# EAGLE design External-Controls (EAGLE 8.0.0)

## Sheet 1 of 2
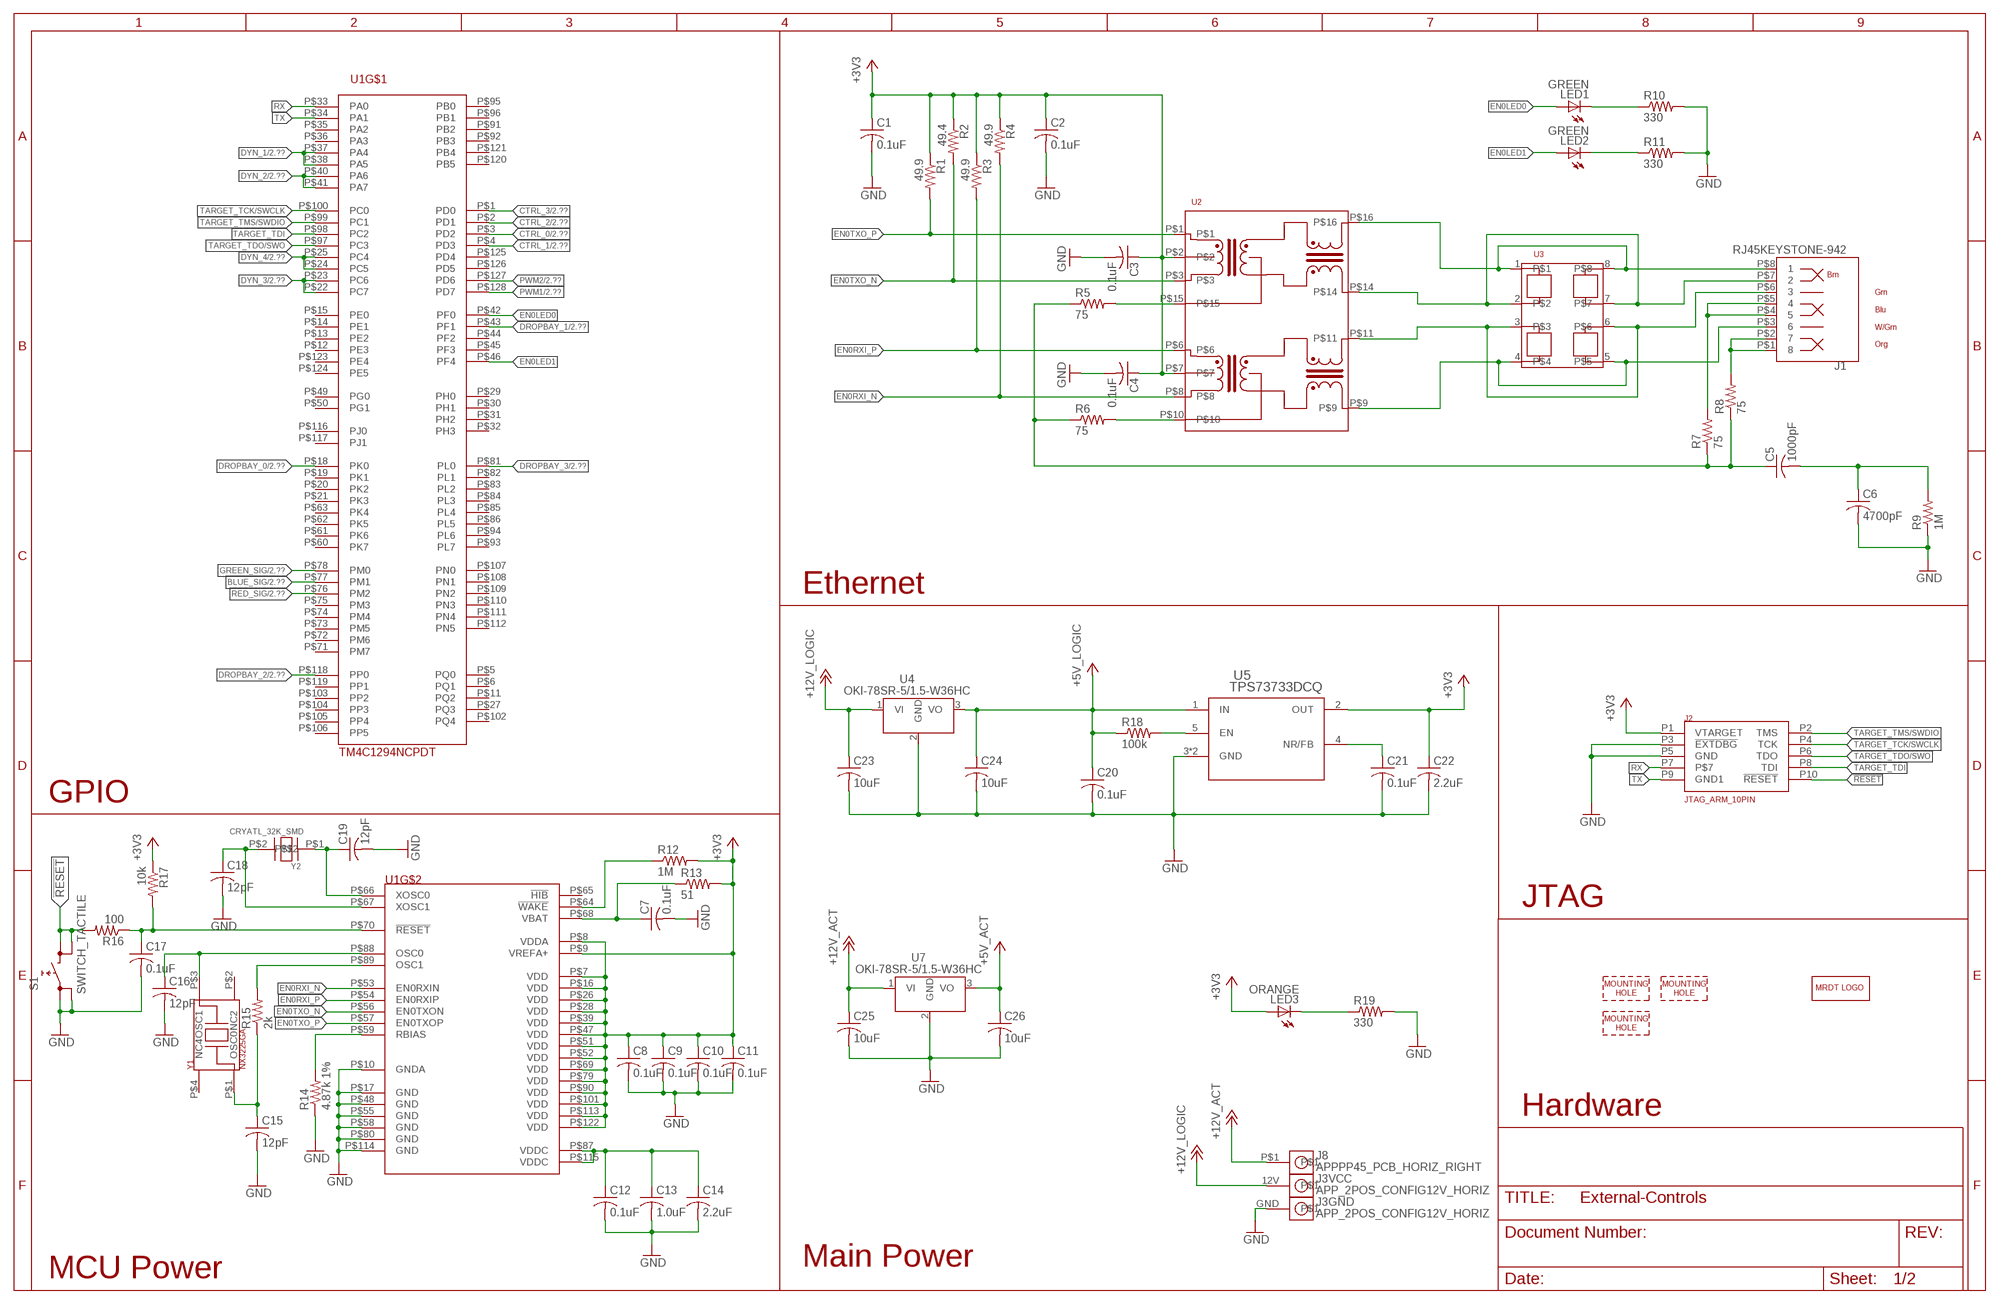
[diagram p0: schematic, sheet 1]

### Parts
C1  0.1uF  C-USC0603  [C0603]
C2  0.1uF  C-USC0603  [C0603]
C3  0.1uF  C-USC0603  [C0603]
C4  0.1uF  C-USC0603  [C0603]
C5  1000pF  C-USC0603  [C0603]
C6  4700pF  C-USC1206  [C1206]
C7  0.1uF  C-USC0603  [C0603]
C8  0.1uF  C-USC0603  [C0603]
C9  0.1uF  C-USC0603  [C0603]
C10  0.1uF  C-USC0603  [C0603]
C11  0.1uF  C-USC0603  [C0603]
C12  0.1uF  C-USC0603  [C0603]
C13  1.0uF  C-USC0603  [C0603]
C14  2.2uF  C-USC0603  [C0603]
C15  12pF  C-USC0603  [C0603]
C16  12pF  C-USC0603  [C0603]
C17  0.1uF  C-USC0603  [C0603]
C18  12pF  C-USC0603  [C0603]
C19  12pF  C-USC0603  [C0603]
C20  0.1uF  C-USC0603  [C0603]
C21  0.1uF  C-USC0603  [C0603]
C22  2.2uF  C-USC0603  [C0603]
C23  10uF  C-USC1206  [C1206]
C24  10uF  C-USC1206  [C1206]
C25  10uF  C-USC1206  [C1206]
C26  10uF  C-USC1206  [C1206]
J1  RJ45KEYSTONE-942  [KEYSTONE-942]
J2  JTAG_ARM_10PIN  [CON_2X5_50MIL]
J3  APP_2POS_CONFIG12V_HORIZ  [APP45_12V_HORIZ_CONFIG]
J8  APPPP45_PCB_HORIZ_RIGHT  [APP45_PCB_HORIZ_RIGHT]
LED1  GREEN  LEDCHIP-LED0603  [CHIP-LED0603]
LED2  GREEN  LEDCHIP-LED0603  [CHIP-LED0603]
LED3  ORANGE  LEDCHIP-LED0603  [CHIP-LED0603]
R1  49.9  R-US_R0603  [R0603]
R2  49.4  R-US_R0603  [R0603]
R3  49.9  R-US_R0603  [R0603]
R4  49.9  R-US_R0603  [R0603]
R5  75  R-US_R0603  [R0603]
R6  75  R-US_R0603  [R0603]
R7  75  R-US_R0603  [R0603]
R8  75  R-US_R0603  [R0603]
R9  1M  R-US_R1206  [R1206]
R10  330  R-US_R0603  [R0603]
R11  330  R-US_R0603  [R0603]
R12  1M  R-US_R0603  [R0603]
R13  51  R-US_R0603  [R0603]
R14  4.87k 1%  R-US_R0603  [R0603]
R15  2k  R-US_R0603  [R0603]
R16  100  R-US_R0603  [R0603]
R17  10k  R-US_R0603  [R0603]
R18  100k  R-US_R0603  [R0603]
R19  330  R-US_R0603  [R0603]
S1  SWITCH_TACTILE  [SWITCH_6MM_6MM_TE_CON_SMD]
U1  TM4C1294NCPDT  [TQFP-128]
U2  HX1198FNL  [HX1198FNL]
U3  SLVU2.8-4  [SOIC8]
U4  OKI-78SR-5/1.5-W36HC  [OKI-78SR_HORIZ]
U5  TPS73733DCQ  [SOT-223-6]
U7  OKI-78SR-5/1.5-W36HC  [OKI-78SR_HORIZ]
U$1  MRDT_LOGO  [MRDT_LOGO]
U$2  MOUNTING_HOLE#6  [#6_SCREW]
U$3  MOUNTING_HOLE#6  [#6_SCREW]
U$4  MOUNTING_HOLE#6  [#6_SCREW]
Y1  NX3225GA  [NDK3.2X2.5]
Y2  CRYATL_32K_SMD  [CRYSTAL_32K_SMD]

### Nets
!RESET: J2.P10(!RESET) R16.2 S1.P$3 S1.P$4
+3V3: C1.1 C2.1 C3.1 C4.1 C8.1 C9.1 C10.1 C11.1 C22.1 J2.P1(VTARGET) LED3.A R1.1 R2.1 R3.1 R4.1 R12.2 R13.2 R17.1 U1.P$7(VDD) U1.P$8(VDDA) U1.P$9(VREFA+) U1.P$16(VDD) U1.P$26(VDD) U1.P$28(VDD) U1.P$39(VDD) U1.P$47(VDD) U1.P$51(VDD) U1.P$52(VDD) U1.P$69(VDD) U1.P$79(VDD) U1.P$90(VDD) U1.P$101(VDD) U1.P$113(VDD) U1.P$122(VDD) U2.P$2 U2.P$7 U5.2(OUT)
+5V_ACT: C26.1 U7.3(VO) ; also sheet 2
+5V_LOGIC: C20.1 C24.1 R18.1 U4.3(VO) U5.1(IN)
+12V_ACT: C25.1 J8.P$1 U7.1(VI) ; also sheet 2
+12V_LOGIC: C23.1 J3.12V U4.1(VI)
BLUE_SIG: U1.P$77(PM1) ; also sheet 2
CTRL_0: U1.P$3(PD2) ; also sheet 2
CTRL_1: U1.P$4(PD3) ; also sheet 2
CTRL_2: U1.P$2(PD1) ; also sheet 2
CTRL_3: U1.P$1(PD0) ; also sheet 2
DROPBAY_0: U1.P$18(PK0) ; also sheet 2
DROPBAY_1: U1.P$43(PF1) ; also sheet 2
DROPBAY_2: U1.P$118(PP0) ; also sheet 2
DROPBAY_3: U1.P$81(PL0) ; also sheet 2
DYN_1: U1.P$37(PA4) U1.P$38(PA5) ; also sheet 2
DYN_2: U1.P$40(PA6) U1.P$41(PA7) ; also sheet 2
DYN_3: U1.P$22(PC7) U1.P$23(PC6) ; also sheet 2
DYN_4: U1.P$24(PC5) U1.P$25(PC4) ; also sheet 2
EN0LED0: LED1.A U1.P$42(PF0)
EN0LED1: LED2.A U1.P$46(PF4)
EN0RXI_N [Ethernet]: R4.2 U1.P$53(EN0RXIN) U2.P$8
EN0RXI_P [Ethernet]: R3.2 U1.P$54(EN0RXIP) U2.P$6
EN0TXO_N [Ethernet]: R2.2 U1.P$56(EN0TXON) U2.P$3
EN0TXO_P [Ethernet]: R1.2 U1.P$57(EN0TXOP) U2.P$1
GND: C1.2 C2.2 C3.2 C4.2 C6.2 C7.2 C8.2 C9.2 C10.2 C11.2 C12.2 C13.2 C14.2 C15.2 C16.2 C17.2 C18.2 C19.2 C20.2 C21.2 C22.2 C23.2 C24.2 C25.2 C26.2 J2.P3(!EXTDBG) J2.P5(GND) J3.GND R9.1 R10.2 R11.2 R14.1 R19.2 S1.P$1 S1.P$2 U1.P$10(GNDA) U1.P$17(GND) U1.P$48(GND) U1.P$55(GND) U1.P$58(GND) U1.P$80(GND) U1.P$114(GND) U4.2(GND) U5.3(GND) U5.6(GND) U7.2(GND) ; also sheet 2
GREEN_SIG: U1.P$78(PM0) ; also sheet 2
N_$1: R5.2 U2.P$15
N_$3: R6.2 U2.P$10
N_$4: J1.P$7 U2.P$14 U3.2 U3.7
N_$5: J1.P$6 U2.P$11 U3.3 U3.6
N_$6: J1.P$8 U2.P$16 U3.1 U3.8
N_$7: J1.P$3 U2.P$9 U3.4 U3.5
N_$8: LED2.C R11.1
N_$9: LED1.C R10.1
N_$10: C7.1 R13.1 U1.P$68(VBAT)
N_$11: J1.P$4 J1.P$5 R7.2
N_$12: R12.1 U1.P$64(!WAKE)
N_$13: J1.P$1 J1.P$2 R8.2
N_$14: C5.1 R5.1 R6.1 R7.1 R8.1
N_$15: C5.2 C6.1 R9.2
N_$16: C12.1 C13.1 C14.1 U1.P$87(VDDC) U1.P$115(VDDC)
N_$17: R15.2 U1.P$89(OSC1)
N_$18: C16.1 U1.P$88(OSC0) Y1.P$3(OSC1)
N_$19: R14.2 U1.P$59(RBIAS)
N_$20: C17.1 R16.1 R17.2 U1.P$70(!RESET)
N_$21: C15.1 R15.1 Y1.P$1(OSC0)
N_$22: C18.1 U1.P$67(XOSC1) Y2.P$2
N_$23: C19.1 U1.P$66(XOSC0) Y2.P$1
N_$25: R18.2 U5.5(EN)
N_$26: LED3.C R19.1
N_$27: C21.1 U5.4(NR/FB)
PWM1: U1.P$128(PD7) ; also sheet 2
PWM2: U1.P$127(PD6) ; also sheet 2
RED_SIG: U1.P$76(PM2) ; also sheet 2
RX: J2.P7 U1.P$33(PA0)
TARGET_TCK/SWCLK: J2.P4(TCK) U1.P$100(PC0)
TARGET_TDI: J2.P8(TDI) U1.P$98(PC2)
TARGET_TDO/SWO: J2.P6(TDO) U1.P$97(PC3)
TARGET_TMS/SWDIO: J2.P2(TMS) U1.P$99(PC1)
TX: J2.P9(GND1) U1.P$34(PA1)
Unconnected: U1.P$5(PQ0) U1.P$6(PQ1) U1.P$11(PQ2) U1.P$12(PE3) U1.P$13(PE2) U1.P$14(PE1) U1.P$15(PE0) U1.P$19(PK1) U1.P$20(PK2) U1.P$21(PK3) U1.P$27(PQ3) U1.P$29(PH0) U1.P$30(PH1) U1.P$31(PH2) U1.P$32(PH3) U1.P$35(PA2) U1.P$36(PA3) U1.P$44(PF2) U1.P$45(PF3) U1.P$49(PG0) U1.P$50(PG1) U1.P$60(PK7) U1.P$61(PK6) U1.P$62(PK5) U1.P$63(PK4) U1.P$65(!HIB) U1.P$71(PM7) U1.P$72(PM6) U1.P$73(PM5) U1.P$74(PM4) U1.P$75(PM3) U1.P$82(PL1) U1.P$83(PL2) U1.P$84(PL3) U1.P$85(PL4) U1.P$86(PL5) U1.P$91(PB2) U1.P$92(PB3) U1.P$93(PL7) U1.P$94(PL6) U1.P$95(PB0) U1.P$96(PB1) U1.P$102(PQ4) U1.P$103(PP2) U1.P$104(PP3) U1.P$105(PP4) U1.P$106(PP5) U1.P$107(PN0) U1.P$108(PN1) U1.P$109(PN2) U1.P$110(PN3) U1.P$111(PN4) U1.P$112(PN5) U1.P$116(PJ0) U1.P$117(PJ1) U1.P$119(PP1) U1.P$120(PB5) U1.P$121(PB4) U1.P$123(PE4) U1.P$124(PE5) U1.P$125(PD4) U1.P$126(PD5) Y1.P$2(NC2) Y1.P$4(NC4)

### Notes on the sheet
- Ethernet
- GPIO
- JTAG
- Hardware
- Main Power
- MCU Power

## Sheet 2 of 2
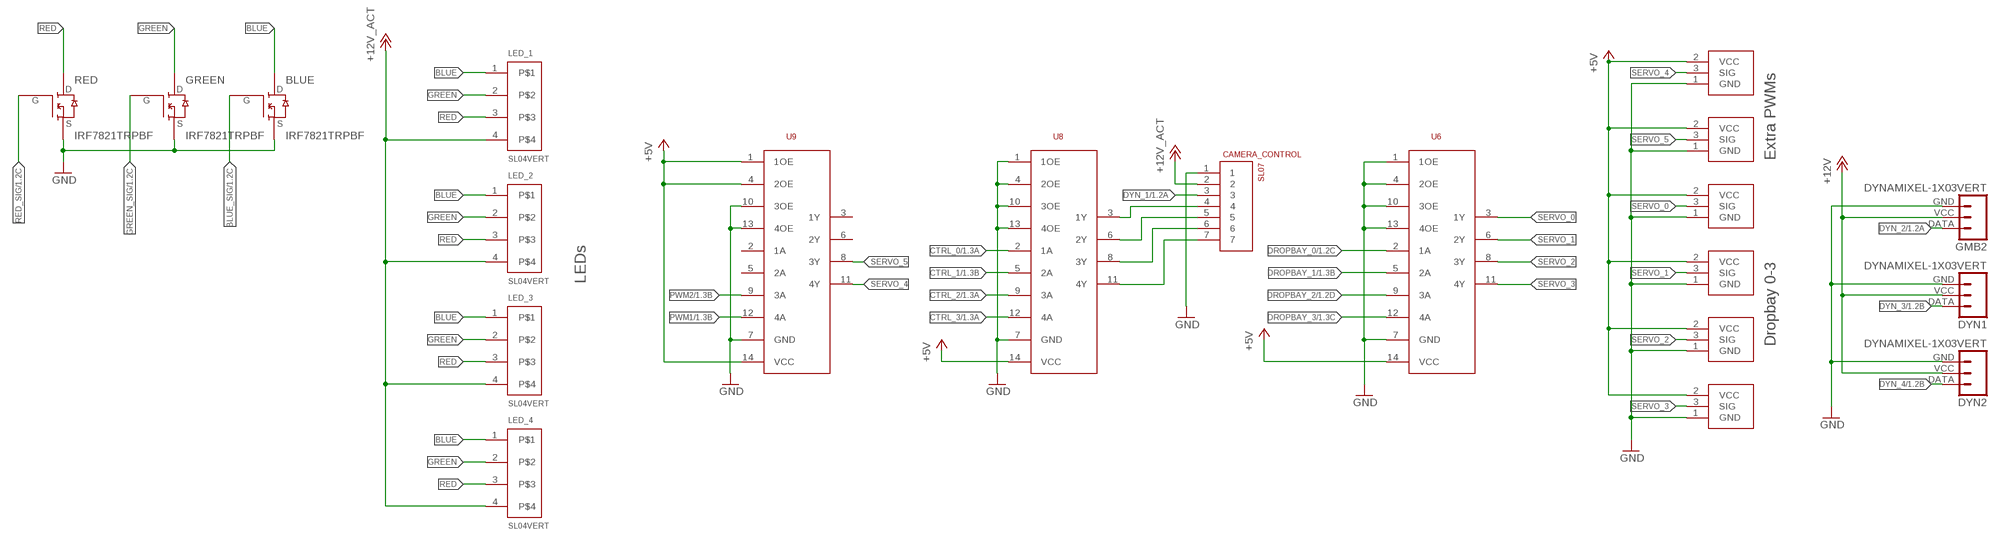
[diagram p1: schematic, sheet 2]

### Parts
BLUE  IRF7821TRPBF  [SOIC8]
CAMERA_CONTROL  SL07  [MOLEX-70543-0006]
DROP0  SERVOMOLEX_SL_VERT_TH  [MOLEX-70543-0002]
DROP1  SERVOMOLEX_SL_VERT_TH  [MOLEX-70543-0002]
DROP2  SERVOMOLEX_SL_VERT_TH  [MOLEX-70543-0002]
DROP3  SERVOMOLEX_SL_VERT_TH  [MOLEX-70543-0002]
DYN1  DYNAMIXEL-1X03VERT  [MLX-SPOX5267-3PIN]
DYN2  DYNAMIXEL-1X03VERT  [MLX-SPOX5267-3PIN]
GMB2  DYNAMIXEL-1X03VERT  [MLX-SPOX5267-3PIN]
GREEN  IRF7821TRPBF  [SOIC8]
LED_1  SL04VERT  [MOLEX-70543-0003]
LED_2  SL04VERT  [MOLEX-70543-0003]
LED_3  SL04VERT  [MOLEX-70543-0003]
LED_4  SL04VERT  [MOLEX-70543-0003]
PWM1  SERVOMOLEX_SL_VERT_TH  [MOLEX-70543-0002]
PWM2  SERVOMOLEX_SL_VERT_TH  [MOLEX-70543-0002]
RED  IRF7821TRPBF  [SOIC8]
U6  SN74AHCT125  [SOIC14]
U8  SN74AHCT125  [SOIC14]
U9  SN74AHCT125  [SOIC14]

### Nets
+5V_ACT: DROP0.2(VCC) DROP1.2(VCC) DROP2.2(VCC) DROP3.2(VCC) PWM1.2(VCC) PWM2.2(VCC) U6.14(VCC) U8.14(VCC) U9.1(1OE) U9.4(2OE) U9.14(VCC) ; supply symbol labelled +5V ; also sheet 1
+12V_ACT: CAMERA_CONTROL.2 DYN1.VCC DYN2.VCC GMB2.VCC LED_1.4 LED_2.4 LED_3.4 LED_4.4 ; supply symbol labelled +12V ; also sheet 1
BLUE: BLUE.5(D) BLUE.6(D) BLUE.7(D) BLUE.8(D) LED_1.1 LED_2.1 LED_3.1 LED_4.1
BLUE_SIG: BLUE.4(G) ; also sheet 1
CAM_PWM_0: CAMERA_CONTROL.4 U8.3(1Y)
CAM_PWM_1: CAMERA_CONTROL.5 U8.6(2Y)
CAM_PWM_2: CAMERA_CONTROL.6 U8.8(3Y)
CAM_PWM_3: CAMERA_CONTROL.7 U8.11(4Y)
CTRL_0: U8.2(1A) ; also sheet 1
CTRL_1: U8.5(2A) ; also sheet 1
CTRL_2: U8.9(3A) ; also sheet 1
CTRL_3: U8.12(4A) ; also sheet 1
DROPBAY_0: U6.2(1A) ; also sheet 1
DROPBAY_1: U6.5(2A) ; also sheet 1
DROPBAY_2: U6.9(3A) ; also sheet 1
DROPBAY_3: U6.12(4A) ; also sheet 1
DYN_1: CAMERA_CONTROL.3 ; also sheet 1
DYN_2: GMB2.DATA ; also sheet 1
DYN_3: DYN1.DATA ; also sheet 1
DYN_4: DYN2.DATA ; also sheet 1
GND: BLUE.1(S) BLUE.2(S) BLUE.3(S) CAMERA_CONTROL.1 DROP0.1(GND) DROP1.1(GND) DROP2.1(GND) DROP3.1(GND) DYN1.GND DYN2.GND GMB2.GND GREEN.1(S) GREEN.2(S) GREEN.3(S) PWM1.1(GND) PWM2.1(GND) RED.1(S) RED.2(S) RED.3(S) U6.1(1OE) U6.4(2OE) U6.7(GND) U6.10(3OE) U6.13(4OE) U8.1(1OE) U8.4(2OE) U8.7(GND) U8.10(3OE) U8.13(4OE) U9.7(GND) U9.10(3OE) U9.13(4OE) ; also sheet 1
GREEN: GREEN.5(D) GREEN.6(D) GREEN.7(D) GREEN.8(D) LED_1.2 LED_2.2 LED_3.2 LED_4.2
GREEN_SIG: GREEN.4(G) ; also sheet 1
PWM1: U9.12(4A) ; also sheet 1
PWM2: U9.9(3A) ; also sheet 1
RED: LED_1.3 LED_2.3 LED_3.3 LED_4.3 RED.5(D) RED.6(D) RED.7(D) RED.8(D)
RED_SIG: RED.4(G) ; also sheet 1
SERVO_0: DROP0.3(SIG) U6.3(1Y)
SERVO_1: DROP1.3(SIG) U6.6(2Y)
SERVO_2: DROP2.3(SIG) U6.8(3Y)
SERVO_3: DROP3.3(SIG) U6.11(4Y)
SERVO_4: PWM2.3(SIG) U9.11(4Y)
SERVO_5: PWM1.3(SIG) U9.8(3Y)
Unconnected: U9.2(1A) U9.3(1Y) U9.5(2A) U9.6(2Y)

### Notes on the sheet
- Extra PWMs
- LEDs
- Dropbay 0-3

## Library data of the parts
BLUE GREEN RED = MRDT-Semiconductors:IRF7821TRPBF: MOSFET N-CH 30V 13.6A; PARTNO: IRF7821TRPBF
C1-C26 = resistor:C-US: CAPACITOR, American symbol
CAMERA_CONTROL = MRDT-Connectors:SL07
DROP0 DROP1-DROP3 PWM1 PWM2 = MRDT-Connectors:SERVO
DYN1 DYN2 GMB2 = MRDT-Connectors:DYNAMIXEL-1X03; MFR: Molex; MFR_PN: 0022035035; ORIENT: Vert
J1 = MRDT-Connectors:RJ45
J2 = MRDT-Connectors:JTAG_ARM_10PIN; PARTNO: M50-3600542
J3 = MRDT-Connectors:APP_2POS_CONFIG; COLOR1: YELLOW; COLOR2: BLACK
J8 = MRDT-Connectors:APP: http://www.powerwerx.com/anderson-powerpoles/
LED1-LED3 = led:LED: LED OSRAM: - CHIPLED LG R971, LG N971, LY N971, LG Q971, LY Q971, LO R971, LY R971 LH N974, LH R974 LS Q976, LO Q976, LY Q976 LO Q996 - Hyper CHIPLED LW Q18S LB Q993, LB Q99A, LB R99A - SideLED LS A670, LO A670, LY A670, LG A670, LP A670 LB A673, LV A673, LT A673, LW A673 LH A674 LY A675 LS A676, LA A676, LO A676, LY A676, LW A676 LS A679, LY A679, LG A679 - Hyper Micro SIDELED® LS Y876, LA Y876, LO Y876, LY Y876 LT Y87S - SmartLED LW L88C, LW L88S LB L89C, LB L89S, LG L890 LS L89K, LO L89K, LY L89K LS L896, LA L896, LO L896, LY L896 - TOPLED LS T670, LO T670, LY T670, LG T670, LP T670 LSG T670, LSP T670, LSY T670, LOP T670, LYG T670 LG T671, LOG T671, LSG T671 LB T673, LV T673, LT T673, LW T673 LH T674 LS T676, LA T676, LO T676, LY T676, LB T676, LH T676, LSB T676, LW T676 LB T67C, LV T67C, LT T67C, LS T67K, LO T67K, LY T67K, LW E67C LS E67B, LA E67B, LO E67B, LY E67B, LB E67C, LV E67C, LT E67C LW T67C LS T679, LY T679, LG T679 LS T770, LO T770, LY T770, LG T770, LP T770 LB T773, LV T773, LT T773, LW T773 LH T774 LS E675, LA E675, LY E675, LS T675 LS T776, LA T776, LO T776, LY T776, LB T776 LHGB T686 LT T68C, LB T68C - Hyper Mini TOPLED® LB M676 - Mini TOPLED Santana® LG M470 LS M47K, LO M47K, LY M47K Source: http://www.osram.convergy.de LUXEON: - LUMILED® LXK2-PW12-R00, LXK2-PW12-S00, LXK2-PW14-U00, LXK2-PW14-V00 LXK2-PM12-R00, LXK2-PM12-S00, LXK2-PM14-U00 LXK2-PE12-Q00, LXK2-PE12-R00, LXK2-PE12-S00, LXK2-PE14-T00, LXK2-PE14-U00 LXK2-PB12-K00, LXK2-PB12-L00, LXK2-PB12-M00, LXK2-PB14-N00, LXK2-PB14-P00, LXK2-PB14-Q00 LXK2-PR12-L00, LXK2-PR12-M00, LXK2-PR14-Q00, LXK2-PR14-R00 LXK2-PD12-Q00, LXK2-PD12-R00, LXK2-PD12-S00 LXK2-PH12-R00, LXK2-PH12-S00 LXK2-PL12-P00, LXK2-PL12-Q00, LXK2-PL12-R00 Source: www.luxeon.com KINGBRIGHT: KA-3528ASYC Source: www.kingbright.com
LED_1-LED_4 = MRDT-Connectors:SL04
R1 = rcl:R-US_: RESISTOR, American symbol
R2-R19 = resistor:R-US_: RESISTOR, American symbol
S1 = MRDT-UserInput:SWITCH_TACTILE
U1 = MRDT-Microcontrollers:TM4C1294NCPDT
U2 = MRDT-ICs:HX1198FNL
U3 = MRDT-ICs:SLVU2.8-4
U4 U7 = MRDT-ICs:OKI-78SR-*/1.5-W36?C: 4.95W DC/DC Converter Manufacturer: Murata; VOUT: +5v
U5 = MRDT-ICs:TPS73733*: LDO with Reverse Current Protection
U6 U8 U9 = MRDT-ICs:SN74AHCT125: part # SN74AHCT125 QUADRUPLE BUS BUFFER GATES WITH 3-STATE OUTPUTS http://www.digikey.com/product-detail/en/SN74AHCT125DR/296-4652-1-ND/405208; PARTNO: SN74AHCT125
U$1 = MRDT-Hardware:MRDT_LOGO
U$2-U$4 = MRDT-Hardware:MOUNTING_HOLE: Mounting hole for M6 bolt. Standard use mounting hole for: Tiva C Connected - M6 Anderson Powerpole Mounting Wing - M8 Most frame-mounted PCB's - M8
Y1 = MRDT-Passives:NX3225GA
Y2 = MRDT-Passives:CRYATL_32K_SMD

## Net classes
2 Ethernet: width 0.22 mm, clearance 0.152 mm

## Board
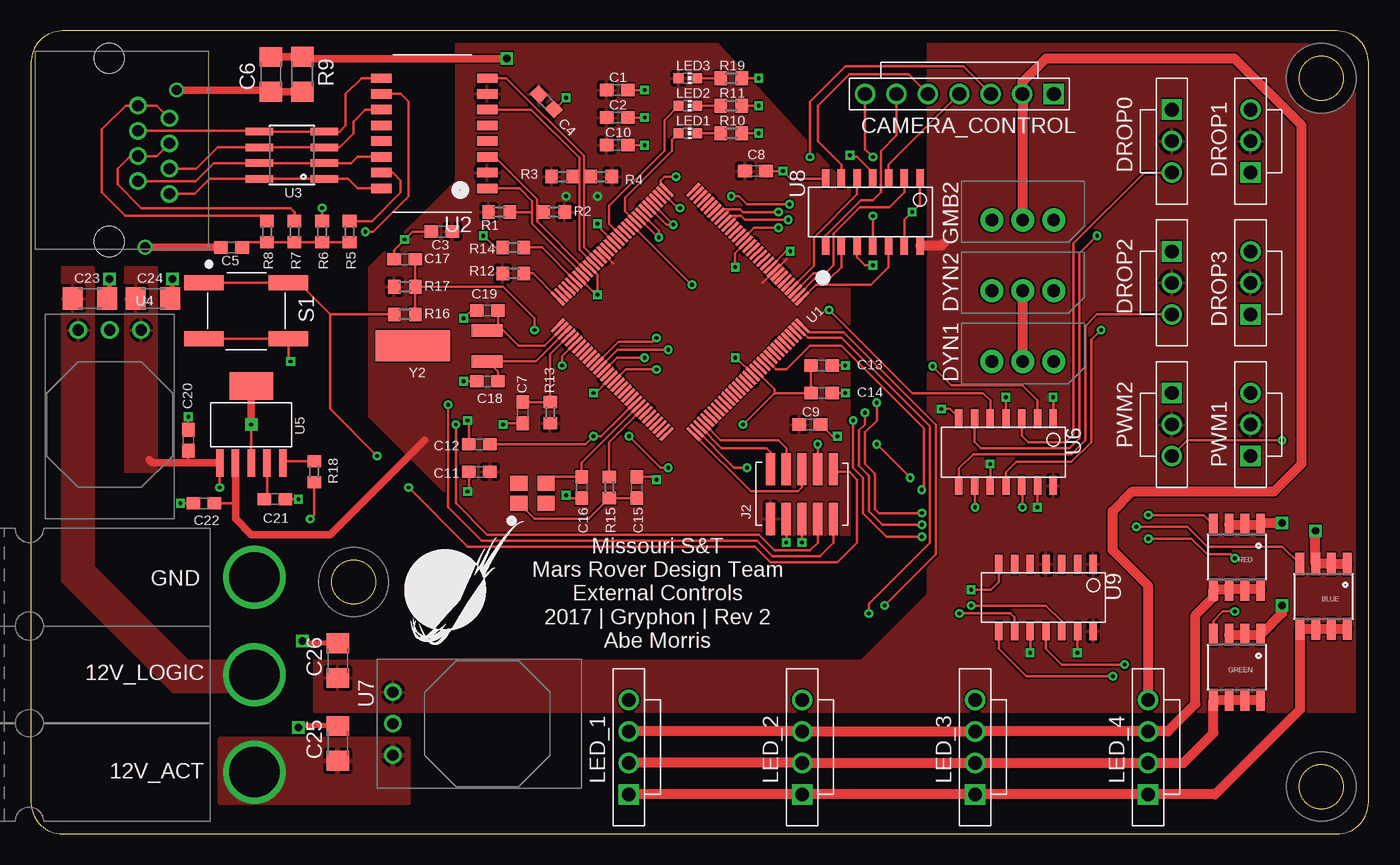
[diagram p2: board, top side]
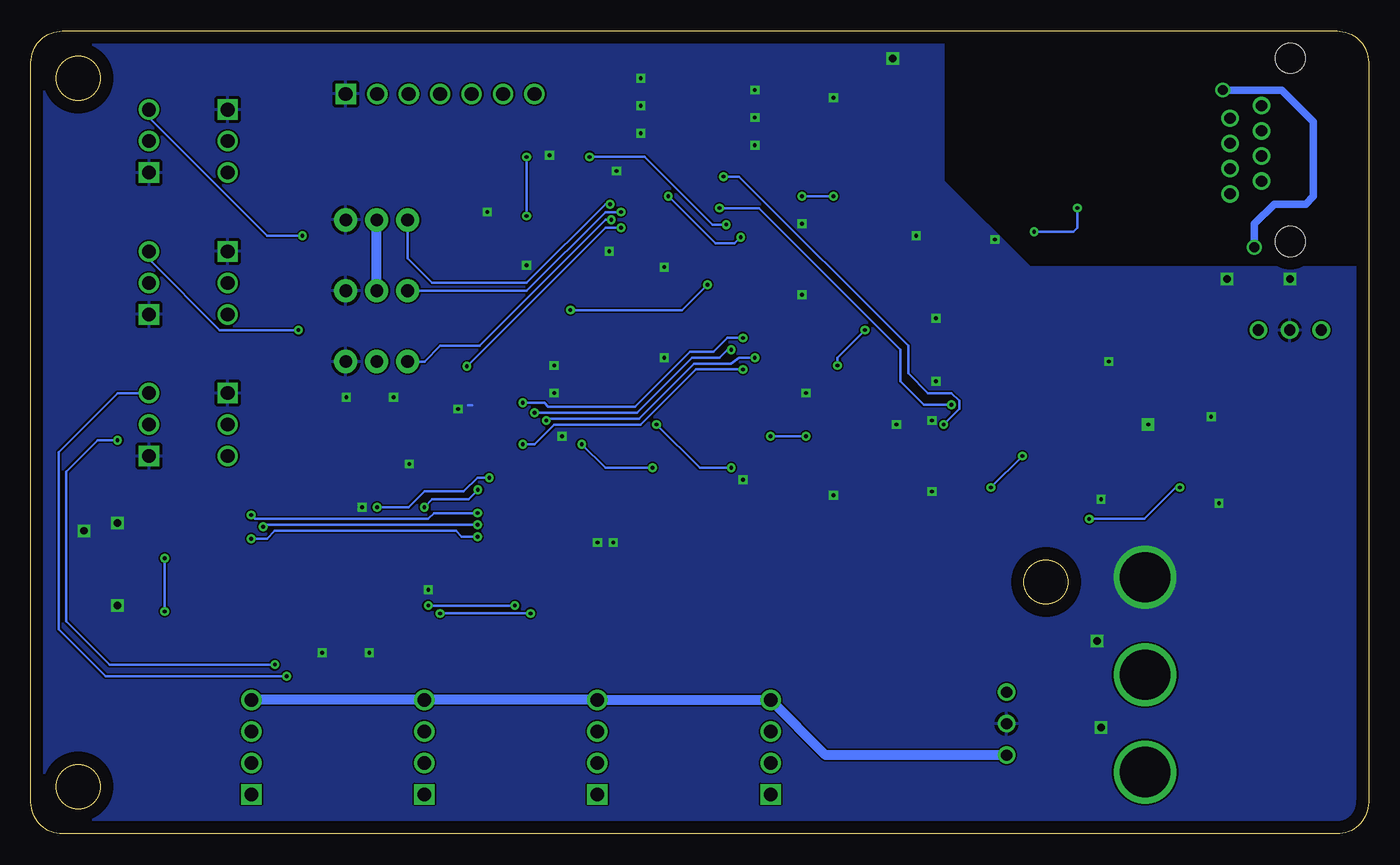
[diagram p3: board, bottom side, seen from below]

Size 107.95 x 64.77 mm. Coordinates in mm from the lower left corner, seen from the top.
Outline: 0,62.23 0,2.54 arc90 2.54,0 105.41,0 arc90 107.95,2.54 107.95,62.23 arc90 105.41,64.77 2.54,64.77 arc90 0,62.23
Copper layers (1*16): Top 0.035mm / dielectric 1.5mm / Bottom 0.035mm
Design rules "advanced_circuits_standard *": minimum track width 5mil, minimum drill 10mil, track to track 5mil, track to pad 5mil, pad to pad 5mil, via to via 5mil, smd to smd 5mil, copper to edge 40mil, drill to drill 5mil, minimum pad ring 10mil, minimum via ring 8mil, stop-mask expansion 4mil, vias tented up to drill 0mil, thermal gap 10mil

### Footprints (pad centres in the part's own frame; a part is rotated, then mirrored left to right if it is on the bottom)
SOIC8 = smd 0.711 x 1.778: 1 0.457,-0.813; 2 1.727,-0.813; 3 2.997,-0.813; 4 4.267,-0.813; 5 4.267,4.419; 6 2.997,4.419; 7 1.727,4.419; 8 0.457,4.419
C0603 = smd 1.1 x 1: 1 -0.85,0; 2 0.85,0
C1206 = smd 1.6 x 1.8: 1 -1.4,0; 2 1.4,0
MOLEX-70543-0006 = drill 1.1 square: 1 7.62,0 | drill 1.1: 2 5.08,0; 3 2.54,0; 4 0,0; 5 -2.54,0; 6 -5.08,0; 7 -7.62,0
MOLEX-70543-0002 = drill 1.1 square: 1 2.54,0 | drill 1.1: 2 0,0; 3 -2.54,0
MLX-SPOX5267-3PIN = drill 1.016 pad 1.88: DATA 5,0; GND 0,0; VCC 2.5,0
KEYSTONE-942 = drill 0.9: P$1 3.8,2.289; P$2 4.816,4.829; P$3 5.832,2.289; P$4 6.848,4.829; P$5 7.864,2.289; P$6 8.88,4.829; P$7 9.896,2.289; P$8 10.912,4.829 | hole 2.413: -0.023,-0.023; 14.76,-0.023
CON_2X5_50MIL = smd 0.74 x 2.6: P1 0,0; P2 0,4.008; P3 1.27,0; P4 1.27,4.008; P5 2.54,0; P6 2.54,4.008; P7 3.81,0; P8 3.81,4.008; P9 5.08,0; P10 5.08,4.008
APP45_12V_HORIZ_CONFIG = drill 4.064: 12V 28.194,3.937; GND 28.194,11.811
APP45_PCB_HORIZ_RIGHT = drill 4.064: P$1 28.194,3.969
CHIP-LED0603 = smd 0.8 x 0.8: A 0,-0.75; C 0,0.75
MOLEX-70543-0003 = drill 1.1 square: 1 3.81,0 | drill 1.1: 2 1.27,0; 3 -1.27,0; 4 -3.81,0
R0603 = smd 1 x 1.1: 1 -0.85,0; 2 0.85,0
R1206 = smd 1.6 x 1.803: 1 -1.422,0; 2 1.422,0
SWITCH_6MM_6MM_TE_CON_SMD = smd 1.2 x 3.2: P$1 4.521,6.807; P$2 4.521,0; P$3 0,6.807; P$4 0,0
TQFP-128 = smd 1.45 x 0.25: P$1 0,0; P$2 0,-0.4; P$3 0,-0.8; P$4 0,-1.2; P$5 0,-1.6; P$6 0,-2; P$7 0,-2.4; P$8 0,-2.8; P$9 0,-3.2; P$10 0,-3.6; P$11 0,-4; P$12 0,-4.4; P$13 0,-4.8; P$14 0,-5.2; P$15 0,-5.6; P$16 0,-6; P$17 0,-6.4; P$18 0,-6.8; P$19 0,-7.2; P$20 0,-7.6; P$21 0,-8; P$22 0,-8.4; P$23 0,-8.8; P$24 0,-9.2; P$25 0,-9.6; P$26 0,-10; P$27 0,-10.4; P$28 0,-10.8; P$29 0,-11.2; P$30 0,-11.6; P$31 0,-12; P$32 0,-12.4; P$65 15.45,-12.4; P$66 15.45,-12; P$67 15.45,-11.6; P$68 15.45,-11.2; P$69 15.45,-10.8; P$70 15.45,-10.4; P$71 15.45,-10; P$72 15.45,-9.6; P$73 15.45,-9.2; P$74 15.45,-8.8; P$75 15.45,-8.4; P$76 15.45,-8; P$77 15.45,-7.6; P$78 15.45,-7.2; P$79 15.45,-6.8; P$80 15.45,-6.4; P$81 15.45,-6; P$82 15.45,-5.6; P$83 15.45,-5.2; P$84 15.45,-4.8; P$85 15.45,-4.4; P$86 15.45,-4; P$87 15.45,-3.6; P$88 15.45,-3.2; P$89 15.45,-2.8; P$90 15.45,-2.4; P$91 15.45,-2; P$92 15.45,-1.6; P$93 15.45,-1.2; P$94 15.45,-0.8; P$95 15.45,-0.4; P$96 15.45,0 | smd 0.25 x 1.45: P$33 1.525,-13.925; P$34 1.925,-13.925; P$35 2.325,-13.925; P$36 2.725,-13.925; P$37 3.125,-13.925; P$38 3.525,-13.925; P$39 3.925,-13.925; P$40 4.325,-13.925; P$41 4.725,-13.925; P$42 5.125,-13.925; P$43 5.525,-13.925; P$44 5.925,-13.925; P$45 6.325,-13.925; P$46 6.725,-13.925; P$47 7.125,-13.925; P$48 7.525,-13.925; P$49 7.925,-13.925; P$50 8.325,-13.925; P$51 8.725,-13.925; P$52 9.125,-13.925; P$53 9.525,-13.925; P$54 9.925,-13.925; P$55 10.325,-13.925; P$56 10.725,-13.925; P$57 11.125,-13.925; P$58 11.525,-13.925; P$59 11.925,-13.925; P$60 12.325,-13.925; P$61 12.725,-13.925; P$62 13.125,-13.925; P$63 13.525,-13.925; P$64 13.925,-13.925; P$97 13.925,1.525; P$98 13.525,1.525; P$99 13.125,1.525; P$100 12.725,1.525; P$101 12.325,1.525; P$102 11.925,1.525; P$103 11.525,1.525; P$104 11.125,1.525; P$105 10.725,1.525; P$106 10.325,1.525; P$107 9.925,1.525; P$108 9.525,1.525; P$109 9.125,1.525; P$110 8.725,1.525; P$111 8.325,1.525; P$112 7.925,1.525; P$113 7.525,1.525; P$114 7.125,1.525; P$115 6.725,1.525; P$116 6.325,1.525; P$117 5.925,1.525; P$118 5.525,1.525; P$119 5.125,1.525; P$120 4.725,1.525; P$121 4.325,1.525; P$122 3.925,1.525; P$123 3.525,1.525; P$124 3.125,1.525; P$125 2.725,1.525; P$126 2.325,1.525; P$127 1.925,1.525; P$128 1.525,1.525
HX1198FNL = smd 0.76 x 1.67: P$1 0,0; P$2 1.27,0; P$3 2.54,0; P$4 3.81,0; P$5 5.08,0; P$6 6.35,0; P$7 7.62,0; P$8 8.89,0; P$9 8.89,8.55; P$10 7.62,8.55; P$11 6.35,8.55; P$12 5.08,8.55; P$13 3.81,8.55; P$14 2.54,8.55; P$15 1.27,8.55; P$16 0,8.55
SOIC8' = smd 0.6 x 2.2: 1 0.457,-0.813; 2 1.727,-0.813; 3 2.997,-0.813; 4 4.267,-0.813; 5 4.267,4.419; 6 2.997,4.419; 7 1.727,4.419; 8 0.457,4.419
OKI-78SR_HORIZ = drill 0.9 pad 1.422: 1 0,0; 2 -2.54,0; 3 -5.08,0
SOT-223-6 = smd 0.6 x 2.2: 1 -2.54,-3.1; 2 -1.27,-3.1; 3 0,-3.1; 4 1.27,-3.1; 5 2.54,-3.1 | smd 3.5 x 2.2: 6 0,3.1
SOIC14 = smd 1.5 x 0.6: 1 1.11,10.16; 2 1.11,8.89; 3 1.11,7.62; 4 1.11,6.35; 5 1.11,5.08; 6 1.11,3.81; 7 1.11,2.54; 8 6.51,2.54; 9 6.51,3.81; 10 6.51,5.08; 11 6.51,6.35; 12 6.51,7.62; 13 6.51,8.89; 14 6.51,10.16
NDK3.2X2.5 = smd 1.4 x 1.2: P$1 0,0; P$2 2.2,0; P$3 2.2,1.6; P$4 0,1.6
CRYSTAL_32K_SMD = smd 2.5 x 1: P$1 0,1.25; P$2 0,-1.25 | smd 6 x 2.5: P$3 -6,0

### Placement (x,y rotation side)
BLUE  106.68,20.95 180 top
C1  47.31,60.01 0 top
C2  47.31,57.78 0 top
C3  33.15,48.58 180 top
C4  41.59,59.05 315 top
C5  16.19,47.31 180 top
C6  19.37,61.28 90 top
C7  39.69,33.97 270 top
C8  58.47,53.47 0 top
C9  62.87,33.02 0 top
C10  47.31,55.56 0 top
C11  36.2,29.21 180 top
C12  36.2,31.43 180 top
C13  63.82,37.78 0 top
C14  63.82,35.56 0 top
C15  48.9,27.94 90 top
C16  44.45,27.94 270 top
C17  30.16,46.35 180 top
C18  36.83,36.51 180 top
C19  36.83,42.23 180 top
C20  12.7,31.75 90 top
C21  19.68,26.99 0 top
C22  13.97,26.67 180 top
C23  4.76,43.18 0 top
C24  9.84,43.18 0 top
C25  24.77,7.3 90 top
C26  24.77,13.97 90 top
CAMERA_CONTROL  74.93,59.69 0 top
DROP0  92.08,55.88 90 top
DROP1  98.42,55.88 270 top
DROP2  92.08,44.45 90 top
DROP3  98.42,44.45 270 top
DYN1  82.55,38.1 180 top
DYN2  82.55,43.81 180 top
GMB2  82.55,49.53 180 top
GREEN  99.69,15.24 180 top
J1  6.35,62.55 270 top
J2  59.69,25.4 0 top
J3  -10.16,8.89 0 top
J8  -10.16,1.02 0 top
LED1  53.02,56.52 270 top
LED2  53.02,58.74 270 top
LED3  53.02,60.96 270 top
LED_1  48.26,6.99 270 top
LED_2  62.23,6.99 270 top
LED_3  76.2,6.99 270 top
LED_4  90.17,6.99 270 top
PWM1  98.42,33.02 270 top
PWM2  92.08,33.02 90 top
R1  37.78,50.16 0 top
R2  42.23,50.16 180 top
R3  42.86,53.02 0 top
R4  46.04,53.02 180 top
R5  25.72,48.58 90 top
R6  23.5,48.58 90 top
R7  21.27,48.58 90 top
R8  19.05,48.58 90 top
R9  21.91,61.28 270 top
R10  56.52,56.52 0 top
R11  56.52,58.74 0 top
R12  38.93,45.21 180 top
R13  41.91,33.97 270 top
R14  38.93,47.31 0 top
R15  46.67,27.94 90 top
R16  30.16,41.91 180 top
R17  30.16,44.13 0 top
R18  22.86,29.21 90 top
R19  56.52,60.96 0 top
RED  99.69,24.13 180 top
S1  13.97,44.45 270 top
U1  62.23,43.18 225 top
U2  36.83,52.07 90 top
U3  SLVU2.8-4  [SOIC8']  22.86,52.39 90 top
U4  3.81,40.64 180 top
U5  17.78,33.02 0 top
U6  72.34,34.59 270 top
U7  29.21,6.35 270 top
U8  61.59,53.98 270 top
U9  75.56,22.86 270 top
U$1  30.12,14.4 0 top
U$2  104.14,3.81 0 top
U$3  26.04,20.32 0 top
U$4  104.14,60.96 90 top
Y1  39.37,26.67 0 top
Y2  36.83,39.37 0 top

### Tracks (layer width: path | path; a pad name or v marks a point on that pad's centre or on a via)
!RESET  (via drill 0.3)
  Top 0.203: J2.P10 64.97,29.21 66.04,29.21 66.67,28.57 66.67,23.5 65.09,21.91 59.69,21.91 58.42,23.18 35.24,23.18 v30.48,27.94 | v27.94,30.48 24.13,34.29 24.13,41.91 | R16.2 24.13,41.91 | 24.13,41.91 21.59,44.45 S1.P$3 S1.P$4
  Bottom 0.203: v30.48,27.94 v27.94,30.48
+3V3  (via drill 0.3)
  Top 0.203: C22.1 16.51,26.67 | U1.P$51 46.21,46.81 46.99,46.04 | U1.P$9 60.05,45.44 | 60.05,45.44 60.96,46.35 | 60.05,45.44 59.05,44.45
  Top 0.61: U5.2 16.51,26.67 16.51,25.4 17.78,24.13 24.13,24.13 31.75,31.75
  Bottom 0.203: v43.18,51.44 v45.72,51.44
  pour Top: 34.29,66.04 34.29,52.7 27.3,45.72 27.3,33.66 36.83,24.13 66.04,24.13 66.04,52.07 53.34,66.04
+5V_ACT
  Top 0.813: U8.14 73.5,47.47 73.66,47.62
  pour Top: 113.03,9.84 113.03,66.04 72.39,66.04 72.39,9.84
  pour Top: 22.86,9.84 22.86,13.97 66.99,13.97 72.71,19.68 72.71,9.84
+5V_LOGIC  (via drill 0.3)
  Top 0.203: C20.1 12.7,29.92 | R18.1 22.86,25.72 v22.54,25.4 | v15.24,27.94 U5.1
  Top 0.61: U5.1 12.7,29.92 9.77,29.92 9.53,30.16
  Bottom 0.203: v22.54,25.4 18.1,25.4 15.56,27.94 v15.24,27.94
  pour Top: 7.62,45.72 7.62,29.21 10.16,29.21 10.16,45.72
+12V_ACT
  Top 0.813: DYN1.VCC DYN2.VCC | GMB2.VCC 80.05,58.38 CAMERA_CONTROL.2 80.01,60.64 81.92,62.55 97.16,62.55 102.55,57.15 102.55,29.84 100.33,27.62 88.9,27.62 87.31,26.04 87.31,22.86 90.17,20 LED_4.4
  Bottom 0.813: DYN2.VCC GMB2.VCC | LED_4.4 LED_3.4 LED_2.4 LED_1.4 43.81,6.35 U7.1
  pour Top: 15.24,7.62 15.24,2.54 30.48,2.54 30.48,7.62
+12V_LOGIC
  pour Top: 2.54,45.72 5.08,45.72 5.08,21.59 12.7,13.97 19.05,13.97 19.05,11.43 11.43,11.43 2.54,20.32
BLUE
  Top 0.813: LED_1.1 LED_2.1 LED_3.1 LED_4.1 95.57,3.17 102.41,10.02 BLUE.5 BLUE.6 BLUE.7 BLUE.8
BLUE_SIG  (via drill 0.3)
  Top 0.203: U1.P$77 47.35,39.05 v51.44,39.05 | v67.31,33.97 67.31,33.02 66.83,32.54 66.83,29.69 67.63,28.89 67.63,26.04 68.74,24.92 v71.91,24.92 | v89.22,24.77 93.34,24.77 94.93,23.18 101,23.18 BLUE.4
  Bottom 0.203: v51.44,39.05 51.75,39.05 52.39,38.42 54.61,38.42 59.05,33.97 v67.31,33.97 | v71.91,24.92 89.06,24.92 v89.22,24.77
CAM_PWM_0
  Top 0.203: U8.3 69.22,53.98 CAMERA_CONTROL.4
CAM_PWM_1
  Top 0.203: U8.6 65.41,53.98 63.5,55.88 63.5,58.74 66.04,61.28 70.8,61.28 CAMERA_CONTROL.5
CAM_PWM_2
  Top 0.203: U8.8 64.14,48.26 66.99,51.12 67.94,51.12 68.58,51.75 68.58,55.09 69.85,56.36 CAMERA_CONTROL.6
CAM_PWM_3  (via drill 0.3)
  Top 0.203: U8.11 v67.94,49.85 | v67.94,54.61 67.31,55.24 CAMERA_CONTROL.7
  Bottom 0.203: v67.94,49.85 v67.94,54.61
CTRL_0
  Top 0.203: U1.P$3 63.16,45.24 64.14,45.24 64.77,45.88 64.77,48.42 66.91,50.56 69.29,50.56 70.48,51.75 U8.2
CTRL_1
  Top 0.203: U1.P$4 63.18,45.83 63.18,48.1 66.67,51.59 U8.5
CTRL_2
  Top 0.203: U1.P$2 63.25,44.77 64.45,44.77 65.41,45.72 U8.9
CTRL_3
  Top 0.203: U1.P$1 63.34,44.29 67.79,44.29 69.22,45.72 U8.12
DROPBAY_0  (via drill 0.3)
  Top 0.203: U1.P$18 57.44,47.99 58.34,48.9 v60.33,48.9 | v72.77,37.72 74.3,36.2 80.01,36.2 81.23,34.98 U6.2
  Bottom 0.203: v60.33,48.9 61.59,48.9 v72.77,37.72
DROPBAY_1  (via drill 0.3)
  Top 0.203: v64.41,42.27 71.12,35.56 76.83,35.56 77.42,34.98 U6.5 | v53.34,44.29 53.3,44.29 U1.P$43
  Bottom 0.203: v64.41,42.27 64.38,42.23 55.4,42.23 v53.34,44.29
DROPBAY_2  (via drill 0.3)
  Top 0.203: U1.P$118 60.13,37.47 60.96,37.47 62.87,39.37 65.41,39.37 72.07,32.7 72.07,27.94 v71.88,27.75 | v76.2,26.35 76.2,28.03 U6.9
  Bottom 0.203: v76.2,26.35 75.56,26.99 72.64,26.99 v71.88,27.75
DROPBAY_3  (via drill 0.3)
  Top 0.203: v50.48,37.47 48.03,37.47 U1.P$81 | v80.01,26.35 80.01,28.03 U6.12 | v68.26,31.43 v70.96,28.73
  Bottom 0.203: v50.48,37.47 54.29,37.47 58.74,33.02 65.72,33.02 67.31,31.43 v68.26,31.43 | 79.96,26.4 v80.01,26.35 77.47,26.35 76.2,27.62 73.03,27.62 71.91,28.73 v70.96,28.73
DYN_1  (via drill 0.3)
  Top 0.203: 50.17,50.79 U1.P$37 v51.84,49.15 51.28,49.15 U1.P$38 | v62.87,54.61 62.87,59.05 65.72,61.91 75.25,61.91 CAMERA_CONTROL.3
  Bottom 0.203: v62.87,54.61 58.42,54.61 52.96,49.15 v51.84,49.15
DYN_2  (via drill 0.3)
  Top 0.203: U1.P$40 49.35,49.97 50.67,48.64 v50.67,48.13 50.59,48.13 U1.P$41 | v56.52,51.44 57.15,51.44 57.78,50.8 v61.21,50.8
  Bottom 0.203: GMB2.DATA 77.55,46.44 75.56,44.45 67.94,44.45 61.59,50.8 v61.21,50.8 | v56.52,51.44 52.7,47.62 51.18,47.62 v50.67,48.13
DYN_3  (via drill 0.3)
  Top 0.203: 56.01,49.42 U1.P$23 56.45,49.85 56.99,49.85 | 56.99,49.85 56.99,49.82 U1.P$22 | 56.99,49.85 57.31,49.85 57.63,49.53 v61.12,49.53
  Bottom 0.203: v61.12,49.53 61.59,49.53 71.75,39.37 74.93,39.37 76.2,38.1 DYN1.DATA
DYN_4  (via drill 0.3)
  Top 0.203: U1.P$25 55.88,50.4 56.44,50.4 | 56.44,50.4 U1.P$24 | 56.44,50.4 57.24,50.4 57.47,50.16 v60.33,50.16
  Bottom 0.203: v60.33,50.16 61.59,50.16 67.94,43.81 DYN2.DATA
EN0LED0
  Top 0.203: U1.P$42 47.94,50.22 47.94,51.31 51.75,55.12 51.75,55.99 LED1.A
EN0LED1
  Top 0.203: U1.P$46 46.67,49.23 46.67,50.67 51.12,55.12 51.12,57.58 LED2.A
EN0RXI_N
  Top 0.22: 44.64,53.02 44.64,47.3 U1.P$53 | 44.64,53.02 44.64,54.69 38.36,60.96 U2.P$8 | R4.2 44.64,53.02
EN0RXI_P
  Top 0.22: 44.26,53.02 44.26,47.11 U1.P$54 | 44.26,53.02 44.26,54.53 40.38,58.42 U2.P$6 | R3.2 44.26,53.02
EN0TXO_N
  Top 0.22: U1.P$56 40.83,49.42 40.83,50.16 | 40.83,50.16 40.83,51.2 37.41,54.61 U2.P$3 | R2.2 40.83,50.16
EN0TXO_P
  Top 0.22: U1.P$57 40.45,49.22 40.45,50.16 | 40.45,50.16 40.45,51.04 39.42,52.07 U2.P$1 | R1.2 40.45,50.16
GND  (via drill 0.3, 0.3 pad 1.02, 0.6)
  Top 0.203: C20.2 v12.7,33.66 | C22.2 v12.06,26.67 | U1.P$58 45.61,43.5 v45.72,43.5 45.72,45.09 U1.P$55 | U1.P$48 45.72,49.05 v45.72,49.21 | C18.2 v34.92,36.51 | C19.2 35.56,42.23 v34.92,41.59 | U1.P$114 56.92,38.42 v56.83,38.42 | U5.3 v17.78,33.02 | C4.2 42.4,58.59 v43.18,59.37 | C21.2 v21.59,26.99 | U1.P$80 45.56,35.56 v45.4,35.56 | C17.2 29.31,47.09 v30.16,47.94 30.8,48.58 C3.2 | C16.2 43.4,27.09 v43.18,27.3 | C15.2 50.27,28.79 v50.48,28.57 | R14.1 37.47,47.31 v36.51,48.26 | S1.P$2 S1.P$1 20.78,38.28 v20.95,38.1 | v73.48,34.28 74.18,34.28 74.88,33.58 U6.7 | C7.2 38.2,33.12 v38.1,33.02 | C12.2 35.34,33.23 v35.24,33.34 | C11.2 35.34,27.73 v35.24,27.62 | C14.2 v65.72,35.56 | C13.2 v65.72,37.78 | U1.P$10 60.95,46.99 v61.28,46.99 | R10.2 v58.74,56.52 | R11.2 v58.74,58.74 | C10.2 v49.53,55.56 | C2.2 v49.53,57.78 | C1.2 v49.53,60.01 | C8.2 v60.69,53.47 61.3,52.87 U8.7 | J2.P3 v60.96,23.5 | J2.P5 v62.23,23.5 | U6.13 v81.23,26.34 | v56.83,45.72 56.83,46.83 U1.P$17 | U8.10 66.67,46.51 67.31,45.88 v67.94,45.88 | U8.13 70.48,49.53 v71.12,50.16 71.75,50.8 U8.1 | U8.4 67.94,53.34 66.67,54.61 66.22,54.61 v66.09,54.74 | R19.2 v58.74,60.96 | U9.10 v80.64,14.61 | U9.13 v84.45,14.61 | v65.09,32.07 64.67,32.07 C9.2 | U9.7 78.11,20.32 77.47,19.68 v75.88,19.68 | U6.4 v78.69,35.23 | U6.1 v82.5,35.23 | U6.10 v77.42,29.83
  Top 0.406: C25.2 21.59,8.7 v21.59,8.57 | C26.2 21.91,15.37 v21.91,15.56 | C23.2 6.35,43.18 v6.35,44.77 | C24.2 11.43,43.18 v11.43,44.77
  Top 0.61: U5.6 v17.78,33.02 | C6.2 19.39,62.7 R9.1 22.06,62.55 v38.42,62.55
  Top 0.813: GREEN.3 GREEN.2 GREEN.1 100.97,17.78 v100.97,18.41 | BLUE.1 BLUE.2 BLUE.3 103.66,21.79 v103.66,24.45 | RED.3 RED.2 RED.1 99.38,25.08 v100.97,25.08
  Bottom 0.203: 72.66,34.59 72.34,34.59
  pour Bottom: -1.27,-2.54 -1.27,45.72 27.3,45.72 34.29,52.7 34.29,67.31 111.76,67.31 111.76,-2.54
GREEN
  Top 0.813: LED_1.2 LED_2.2 LED_3.2 LED_4.2 93.03,5.71 95.43,8.12 GREEN.5 | GREEN.5 GREEN.6 GREEN.7 GREEN.8 | 95.43,10.34 GREEN.5
GREEN_SIG  (via drill 0.3)
  Top 0.203: U1.P$78 47.28,38.42 v49.53,38.42 | v66.36,33.34 66.36,29.53 67.15,28.73 67.15,25.88 69.06,23.97 v71.91,23.97 | v97.16,22.23 96.84,22.54 94.93,22.54 93.66,23.81 v90.17,23.81 | v97.16,17.94 96.2,17.94 95.41,17.14 95.41,16.07 GREEN.4
  Bottom 0.203: v49.53,38.42 50.8,38.42 51.44,37.94 54.45,37.94 58.9,33.5 66.2,33.5 v66.36,33.34 | v97.16,22.23 v97.16,17.94 | v71.91,23.97 73.18,23.97 73.66,24.45 88.27,24.45 88.9,23.81 v90.17,23.81
N_$1
  Top 0.203: U2.P$15 29.21,53.34 29.84,52.7 29.84,51.75 27.52,49.43 R5.2
N_$3  (via drill 0.3)
  Top 0.203: R6.2 v23.5,50.48 | v26.99,48.58 27.62,48.58 30.48,51.44 30.48,59.05 29.84,59.69 U2.P$10
  Bottom 0.203: v23.5,50.48 23.5,48.9 23.81,48.58 v26.99,48.58
N_$4
  Top 0.203: J1.P$7 13.28,52.65 14.74,54.11 U3.7 U3.2 25.86,54.11 26.35,54.61 U2.P$14
N_$5
  Top 0.203: J1.P$6 13.35,53.67 15.06,55.38 U3.6 U3.3 24.9,55.38 26.04,56.52 26.04,57.47 26.99,58.42 U2.P$11
N_$6
  Top 0.203: J1.P$8 13.22,51.64 14.43,52.84 U3.8 U3.1 25.58,52.84 26.35,52.07 U2.P$16
N_$7
  Top 0.203: J1.P$3 18.38,56.72 U3.5 U3.4 24.9,56.65 25.4,57.15 25.4,59.69 26.67,60.96 U2.P$9
N_$8
  Top 0.203: LED2.C R11.1
N_$9
  Top 0.203: LED1.C R10.1
N_$10
  Top 0.203: C7.1 R13.1 41.91,38.7 U1.P$68
N_$11
  Top 0.203: J1.P$4 10.16,54.68 J1.P$5 8.01,54.68 6.99,53.66 6.99,52.39 8.89,50.48 20.95,50.48 21.27,50.16 R7.2
N_$12
  Top 0.203: U1.P$64 40.51,45.21 R12.1
N_$13
  Top 0.203: J1.P$2 10.16,58.75 J1.P$1 7.63,58.75 5.71,56.83 5.71,51.75 7.62,49.85 18.63,49.85 R8.2
N_$14
  Top 0.203: R5.1 R6.1 R7.1 R8.1 17.46,47.73 C5.1
N_$15  (via drill 0.8)
  Top 0.61: C5.2 v9.21,47.31 | R9.2 19.39,59.85 C6.1 19.24,60.01 v11.75,60.01
  Bottom 0.61: v11.75,60.01 6.99,60.01 4.45,57.47 4.45,51.44 5.08,50.8 7.62,50.8 9.21,49.21 v9.21,47.31
N_$16  (via drill 0.3)
  Top 0.203: 46.99,33.02 48.26,34.29 48.26,34.3 U1.P$87 46.03,32.07 v45.4,32.07 44.77,31.43 C12.1 | v48.26,32.07 50.8,29.53 v51.44,29.53 | v57.47,33.02 60.01,35.56 | 60.01,35.56 60.01,35.88 58.55,37.33 U1.P$115 | 60.01,35.56 C14.1 C13.1
  Bottom 0.203: v45.4,32.07 v48.26,32.07 | v51.44,29.53 53.98,29.53 v57.47,33.02
N_$17
  Top 0.203: U1.P$89 46.67,31.58 R15.2
N_$18
  Top 0.203: U1.P$88 44.45,29.93 C16.1 42.09,28.79 Y1.P$3
N_$19
  Top 0.203: U1.P$59 41.24,47.31 R14.2
N_$20  (via drill 0.3)
  Top 0.203: v42.86,37.78 42.86,38.52 U1.P$70 | v40.64,40.64 40.64,41.59 38.1,44.13 R17.2 | R16.1 R17.2 | R17.2 C17.1
  Bottom 0.203: v42.86,37.78 42.86,38.42 v40.64,40.64
N_$21
  Top 0.203: Y1.P$1 40.64,25.4 44.98,25.4 R15.1 C15.1
N_$22
  Top 0.203: U1.P$67 40.77,38.12 Y2.P$2 37.68,37.27 C18.1
N_$23
  Top 0.203: 38.12,40.62 Y2.P$1 | 38.12,40.62 39.37,39.37 41.45,39.37 U1.P$66 | C19.1 37.68,41.06 38.12,40.62
N_$25
  Top 0.203: U5.5 20.38,29.86 20.58,30.06 R18.2
N_$26
  Top 0.203: LED3.C R19.1
N_$27
  Top 0.203: 19.04,29.2 19.05,29.21 | 19.05,29.21 U5.4 | C21.1 19.05,27.2 19.05,29.21
PWM1  (via drill 0.3)
  Top 0.203: U1.P$128 62.77,40.48 65.56,40.48 73.03,33.02 73.03,22.54 v68.9,18.41 | U9.12 83.19,17.14 81.92,18.41 v75.88,18.41
  Bottom 0.203: v68.9,18.41 v75.88,18.41
PWM2  (via drill 0.3)
  Top 0.203: U1.P$127 61.97,40.74 62.71,40.01 65.41,40.01 72.55,32.86 72.55,23.5 67.63,18.57 v67.63,17.78 | U9.9 79.38,17.46 79.06,17.78 v74.93,17.78
  Bottom 0.203: v67.63,17.78 v74.93,17.78
RED
  Top 0.813: LED_1.3 LED_2.3 LED_3.3 LED_4.3 91.76,8.26 93.98,10.48 93.98,17.63 95.43,19.08 RED.5 RED.6 RED.7 RED.8
RED_SIG  (via drill 0.3)
  Top 0.203: U1.P$76 47.42,39.69 50.16,39.69 v50.48,40.01 | v68.26,34.77 68.26,33.34 67.31,32.38 67.31,29.84 68.1,29.05 68.1,26.19 68.42,25.88 v71.91,25.88 | RED.4 94.65,25.72 v90.17,25.72
  Bottom 0.203: v50.48,40.01 51.75,40.01 52.86,38.89 54.77,38.89 59.21,34.45 66.2,34.45 66.52,34.77 v68.26,34.77 | v71.91,25.88 75.41,25.88 75.88,25.4 89.85,25.4 v90.17,25.72
RX  (via drill 0.3)
  Top 0.203: U1.P$33 50.8,52.45 50.8,52.7 51.12,53.02 v52.07,53.02 | v34.29,33.02 34.29,26.67 36.83,24.13 58.74,24.13 60.01,22.86 62.87,22.86 63.5,23.5 J2.P7
  Bottom 0.203: v34.29,33.02 33.02,34.29 33.02,34.92 33.66,35.56 35.56,35.56 37.15,37.15 37.15,39.37 50.8,53.02 v52.07,53.02
SERVO_0
  Top 0.203: U6.3 79.96,32.12 80.49,31.59 83.5,31.59 84.14,32.23 84.14,47.62 89.85,53.34 DROP0.3
SERVO_1  (via drill 0.3)
  Top 0.203: U6.6 76.15,31.64 76.68,31.11 83.82,31.11 84.61,31.91 84.61,46.83 v86.04,48.26
  Bottom 0.203: DROP1.3 98.42,57.78 88.9,48.26 v86.04,48.26
SERVO_2
  Top 0.203: DROP2.3 86.04,41.91 85.09,40.96 85.09,31.75 83.98,30.64 76.04,30.64 74.88,29.48 U6.8
SERVO_3  (via drill 0.3)
  Top 0.203: v86.36,40.64 85.57,39.85 85.57,31.59 83.98,30 79.53,30 78.69,29.16 U6.11
  Bottom 0.203: v86.36,40.64 92.71,40.64 98.42,46.35 DROP3.3
SERVO_4  (via drill 0.3)
  Top 0.203: U9.11 82.13,16.22 81.92,16 81.92,14.92 83.19,13.65 v88.27,13.65 | v100.97,31.75 93.34,31.75 PWM2.3
  Bottom 0.203: v88.27,13.65 101.6,13.65 105.09,17.14 105.09,29.21 102.55,31.75 v100.97,31.75
SERVO_5  (via drill 0.3)
  Top 0.203: U9.8 78.11,14.92 80.33,12.7 v87.31,12.7
  Bottom 0.203: PWM1.3 100.97,35.56 105.73,30.8 105.73,16.51 101.92,12.7 v87.31,12.7
TARGET_TCK/SWCLK
  Top 0.203: J2.P4 60.96,31.11 60.33,31.75 55.66,31.75 U1.P$100
TARGET_TDI  (via drill 0.3)
  Top 0.203: v57.78,29.53 56.76,29.53 U1.P$98 | v63.5,31.43 J2.P8
  Bottom 0.203: v57.78,29.53 61.59,29.53 v63.5,31.43
TARGET_TDO/SWO
  Top 0.203: J2.P6 62.23,27.94 61.91,27.62 58.09,27.62 U1.P$97
TARGET_TMS/SWDIO
  Top 0.203: J2.P2 59.69,30.8 59.37,31.11 55.73,31.11 U1.P$99
TX  (via drill 0.3)
  Top 0.203: v33.66,34.61 33.66,26.35 36.35,23.65 58.58,23.65 59.85,22.38 63.66,22.38 64.77,23.5 J2.P9 | U1.P$34 52.2,50.48 v52.39,50.48
  Bottom 0.203: v52.39,50.48 49.21,50.48 37.78,39.05 37.78,36.51 35.88,34.61 v33.66,34.61

### Text on the board
tPlace: GND | Missouri S&T / Mars Rover Design Team / External Controls / 2017 | Gryphon | Rev 2 / Abe Morris | 12V_LOGIC | 12V_ACT